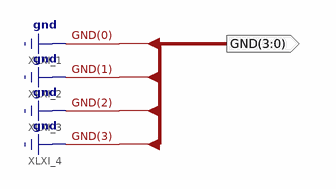
[diagram p0: schematic sheet 1]
// Xilinx ISE schematic gnd4.sch (spartan6) as structural Verilog: 0 symbols, 1 ports
module gnd4 (
  output [3:0] GND
);


  assign GND = 4'b0000;
endmodule
